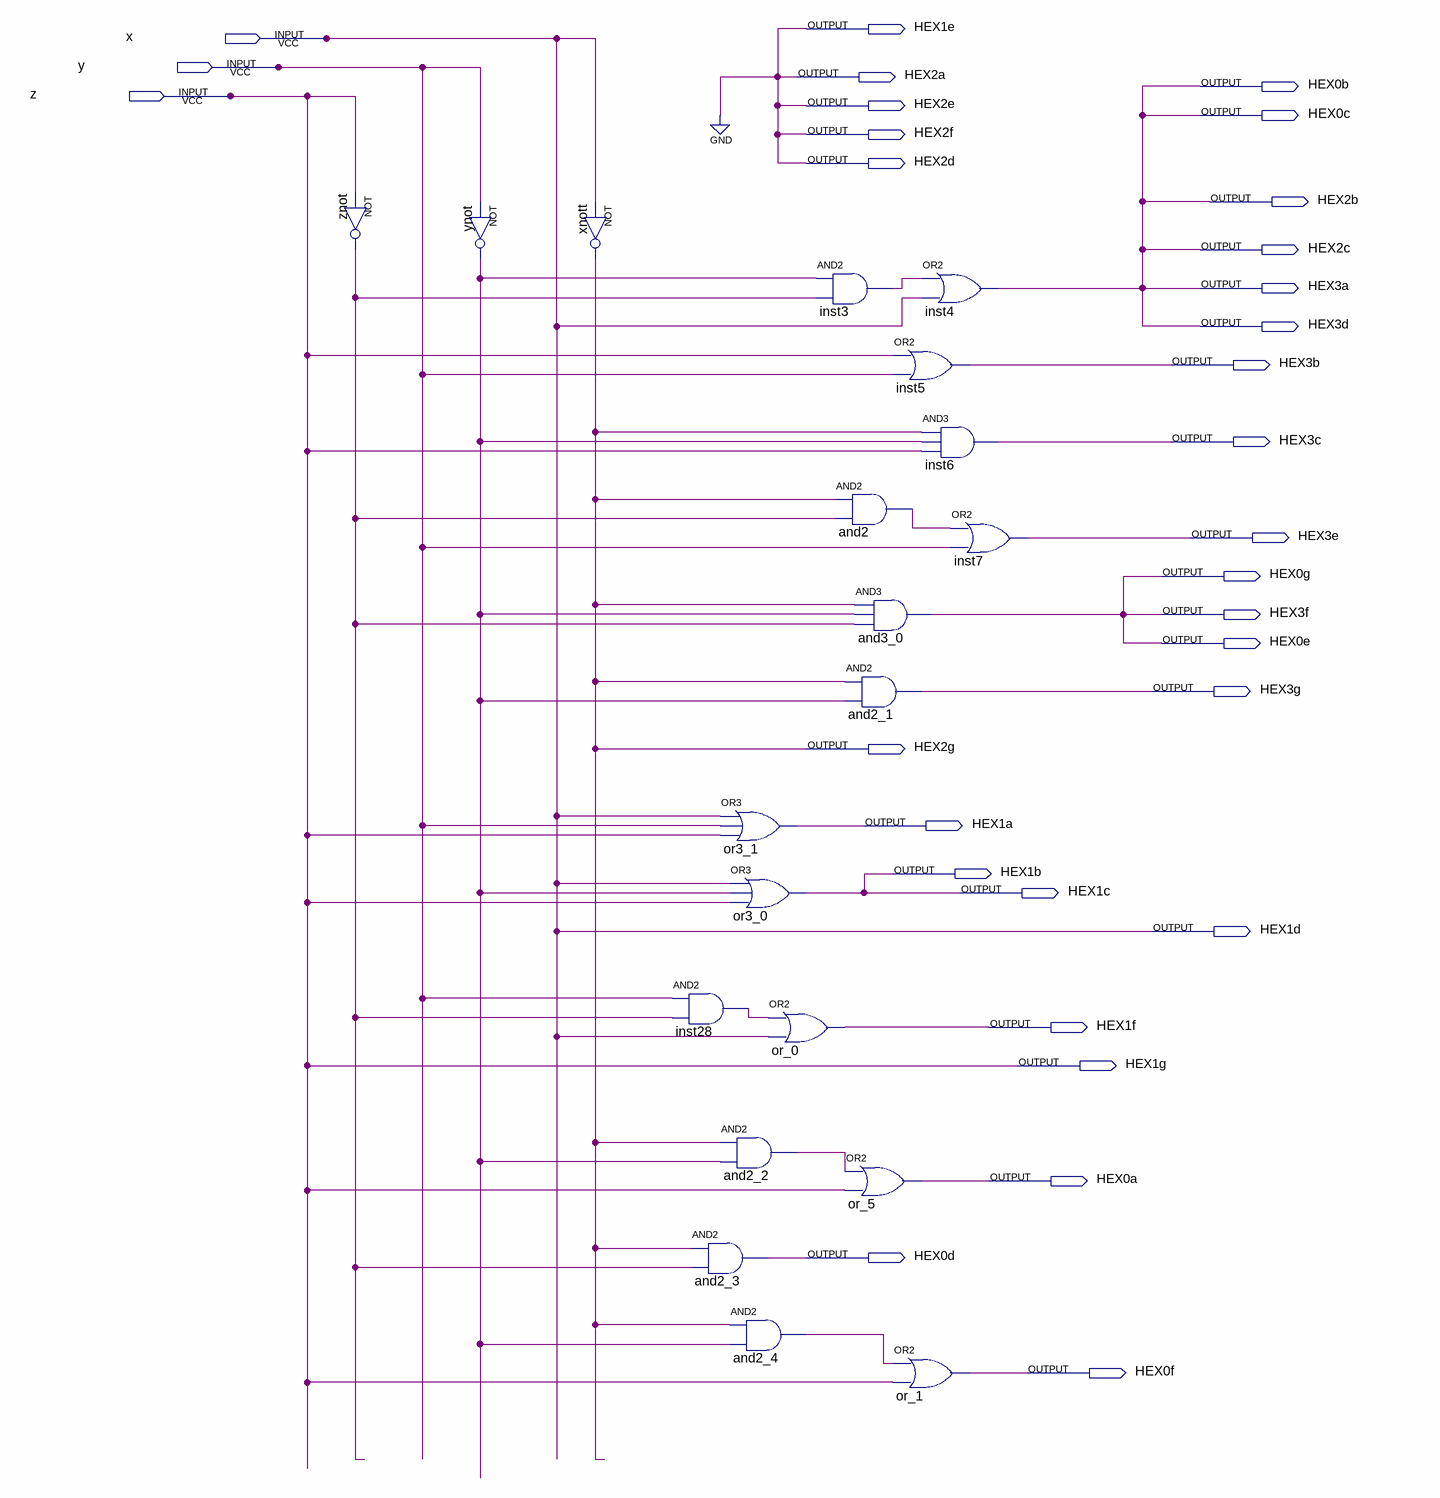
[diagram p0: schematic sheet]
// Quartus schematic ICE_COLd_SOdA_SOLd_HErE.bdf as structural Verilog: 20 symbols, 31 pins
module ICE_COLd_SOdA_SOLd_HErE (
  input  x,
  input  y,
  input  z,
  output HEX1e,
  output HEX2a,
  output HEX0b,
  output HEX2e,
  output HEX0c,
  output HEX2f,
  output HEX2d,
  output HEX2b,
  output HEX2c,
  output HEX3a,
  output HEX3d,
  output HEX3b,
  output HEX3c,
  output HEX3e,
  output HEX0g,
  output HEX3f,
  output HEX0e,
  output HEX3g,
  output HEX2g,
  output HEX1a,
  output HEX1b,
  output HEX1c,
  output HEX1d,
  output HEX1f,
  output HEX1g,
  output HEX0a,
  output HEX0d,
  output HEX0f
);

  wire and2_2_out, and2_4_out, and2_out, inst3_out, inst28_out, ynot_out, znot_out;

  not znot (znot_out, z);
  not ynot (ynot_out, y);
  not xnott (HEX2g, x);
  or or3_1 (HEX1a, x, y, z);
  or or3_0 (HEX1b, x, ynot_out, z);
  and inst28 (inst28_out, y, znot_out);
  and and2_2 (and2_2_out, HEX2g, ynot_out);
  and and2_3 (HEX0d, HEX2g, znot_out);
  and and2_4 (and2_4_out, HEX2g, ynot_out);
  and inst3 (inst3_out, ynot_out, znot_out);
  or or_0 (HEX1f, inst28_out, x);
  or inst5 (HEX3b, z, y);
  and and2 (and2_out, HEX2g, znot_out);
  and and3_0 (HEX0e, HEX2g, ynot_out, znot_out);
  and and2_1 (HEX3g, HEX2g, ynot_out);
  or or_5 (HEX0a, and2_2_out, z);
  or or_1 (HEX0f, and2_4_out, z);
  or inst4 (HEX0b, inst3_out, x);
  and inst6 (HEX3c, HEX2g, ynot_out, z);
  or inst7 (HEX3e, and2_out, y);

  assign HEX0c = HEX0b;
  assign HEX0g = HEX0e;
  assign HEX1c = HEX1b;
  assign HEX1d = x;
  assign HEX1e = 1'b0;
  assign HEX1g = z;
  assign HEX2a = 1'b0;
  assign HEX2b = HEX0b;
  assign HEX2c = HEX0b;
  assign HEX2d = 1'b0;
  assign HEX2e = 1'b0;
  assign HEX2f = 1'b0;
  assign HEX3a = HEX0b;
  assign HEX3d = HEX0b;
  assign HEX3f = HEX0e;
endmodule
